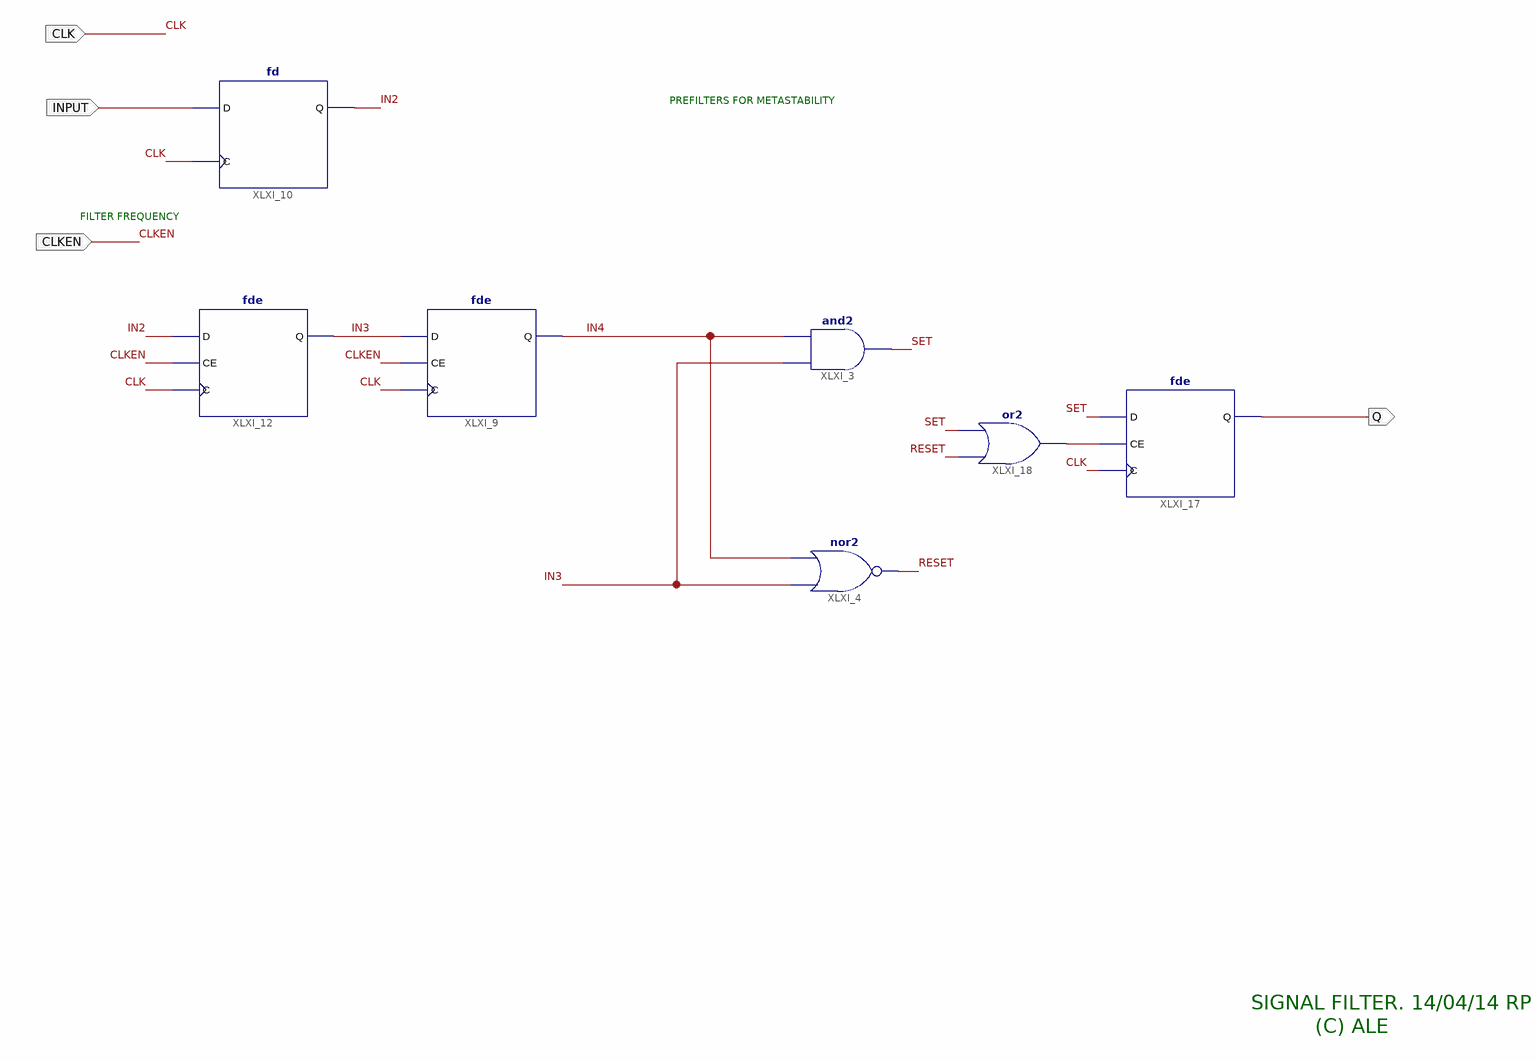
[diagram p0: schematic sheet 1]
// Xilinx ISE schematic Filter.sch (spartan3e) as structural Verilog: 7 symbols, 4 ports
module Filter (
  input  CLK,
  input  CLKEN,
  input  INPUT,
  output Q
);

  wire IN2, IN3, IN4, RESET, SET, XLXN_38;

  and XLXI_3 (SET, IN3, IN4);
  nor XLXI_4 (RESET, IN3, IN4);
  fde XLXI_9 (.C(CLK), .CE(CLKEN), .D(IN3), .Q(IN4));
  fd XLXI_10 (.C(CLK), .D(INPUT), .Q(IN2));
  fde XLXI_12 (.C(CLK), .CE(CLKEN), .D(IN2), .Q(IN3));
  fde XLXI_17 (.C(CLK), .CE(XLXN_38), .D(SET), .Q(Q));
  or XLXI_18 (XLXN_38, RESET, SET);

  // Notes on the sheet:
  //   PREFILTERS FOR METASTABILITY
  //   FILTER FREQUENCY
  //   SIGNAL FILTER. 14/04/14 RP
  //   (C) ALE
endmodule
